# EAGLE design timer (EAGLE 6.2)
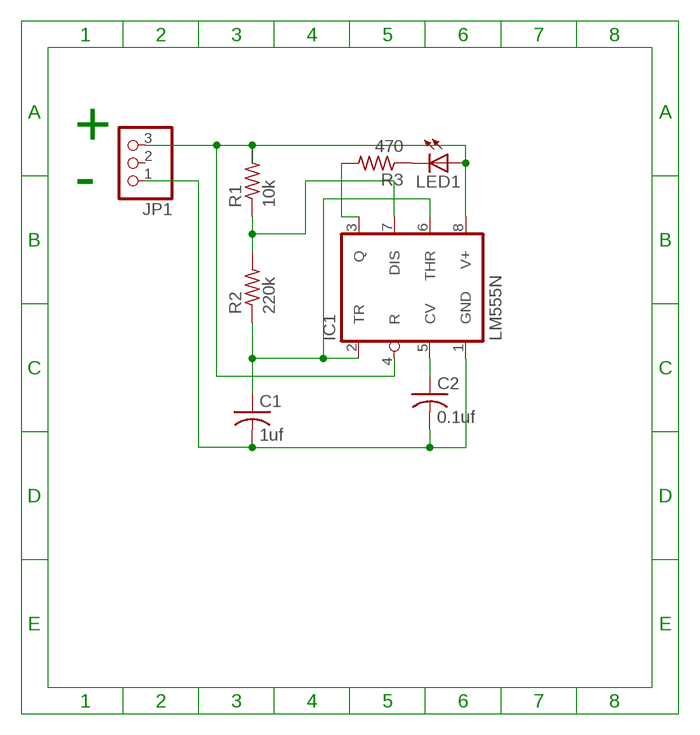
[diagram p0: schematic, sheet 1]

## Parts
C1  1uf  C-US050-025X075  [C050-025X075]
C2  0.1uf  C-US050-025X075  [C050-025X075]
IC1  LM555N  [DIL08-ROUND]
JP1  PINHD-1X3  [1X03]
LED1  LED5MM  [LED5MM]
R1  10k  R-US_0309/10  [0309/10]
R2  220k  R-US_0309/10  [0309/10]
R3  470  R-US_0309/10  [0309/10]

## Nets
N$1: C2.1 IC1.5(CV)
N$2: LED1.K(C) R3.1
N$3: IC1.7(DIS) R1.1 R2.2
N$4: IC1.3(Q) R3.2
N$5: C1.2 C2.2 IC1.1(GND) JP1.1
N$7: IC1.4(R) IC1.8(V+) JP1.3 LED1.A R1.2
N$9: C1.1 IC1.2(TR) IC1.6(THR) R2.1
Unconnected: JP1.2

## Notes on the sheet
- +
- -

## Library data of the parts
C1 C2 = adafruit:C-US: CAPACITOR, American symbol
IC1 = adafruit:*555: TIMER Changed DIP package to have round (not oval) pin pads http://www.ladyada.net/library/pcb/eaglelibrary.html
JP1 = adafruit:PINHD-1X3: PIN HEADER
LED1 = adafruit:LED: LED OSRAM: - CHIPLED LG R971, LG N971, LY N971, LG Q971, LY Q971, LO R971, LY R971 LH N974, LH R974 LS Q976, LO Q976, LY Q976 LO Q996 - Hyper CHIPLED LW Q18S LB Q993, LB Q99A, LB R99A - SideLED LS A670, LO A670, LY A670, LG A670, LP A670 LB A673, LV A673, LT A673, LW A673 LH A674 LY A675 LS A676, LA A676, LO A676, LY A676, LW A676 LS A679, LY A679, LG A679 - Hyper Micro SIDELED® LS Y876, LA Y876, LO Y876, LY Y876 LT Y87S - SmartLED LW L88C, LW L88S LB L89C, LB L89S, LG L890 LS L89K, LO L89K, LY L89K LS L896, LA L896, LO L896, LY L896 - TOPLED LS T670, LO T670, LY T670, LG T670, LP T670 LSG T670, LSP T670, LSY T670, LOP T670, LYG T670 LG T671, LOG T671, LSG T671 LB T673, LV T673, LT T673, LW T673 LH T674 LS T676, LA T676, LO T676, LY T676, LB T676, LH T676, LSB T676, LW T676 LB T67C, LV T67C, LT T67C, LS T67K, LO T67K, LY T67K, LW E67C LS E67B, LA E67B, LO E67B, LY E67B, LB E67C, LV E67C, LT E67C LW T67C LS T679, LY T679, LG T679 LS T770, LO T770, LY T770, LG T770, LP T770 LB T773, LV T773, LT T773, LW T773 LH T774 LS E675, LA E675, LY E675, LS T675 LS T776, LA T776, LO T776, LY T776, LB T776 LHGB T686 LT T68C, LB T68C - Hyper Mini TOPLED® LB M676 - Mini TOPLED Santana® LG M470 LS M47K, LO M47K, LY M47K Source: http://www.osram.convergy.de/
R1-R3 = adafruit:R-US_: RESISTOR, American symbol

## Board
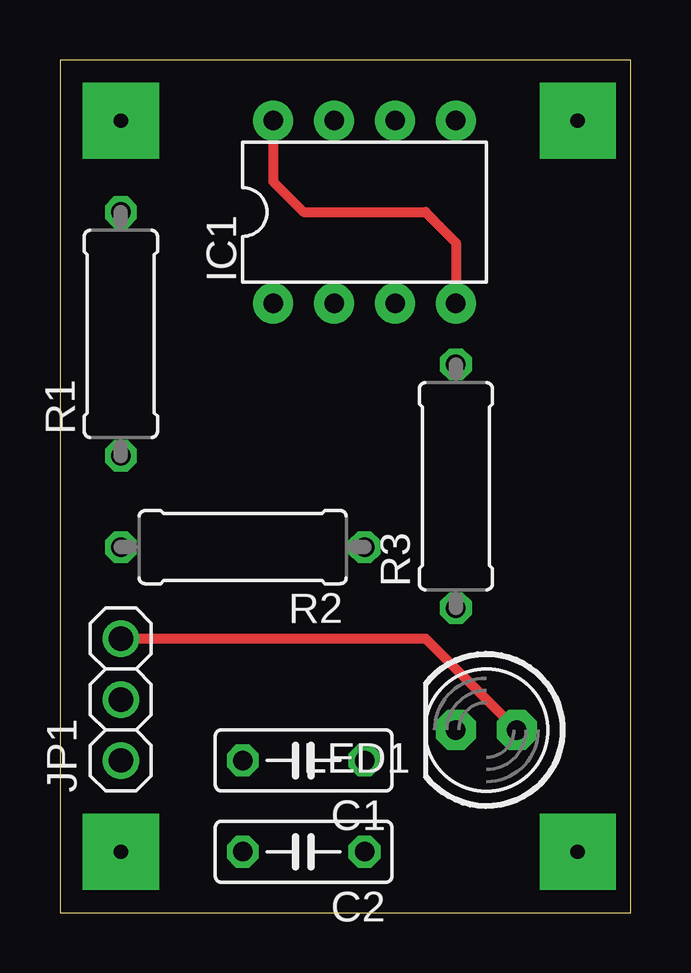
[diagram p1: board, top side]
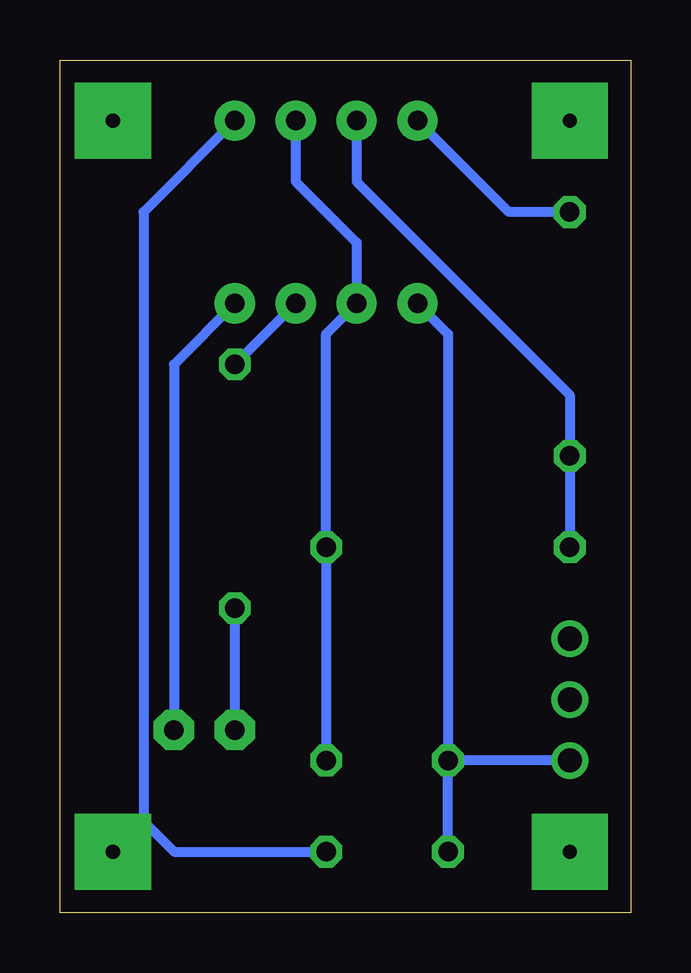
[diagram p2: board, bottom side, seen from below]

Size 23.8 x 35.55 mm. Coordinates in mm from the lower left corner, seen from the top.
Outline: 0,0 23.8,0 23.8,35.55 0,35.55 0,0
Copper layers (1*16): Top 0.035mm / dielectric 1.5mm / Bottom 0.035mm
Design rules "default": minimum track width 10mil, minimum drill 24mil, track to track 8mil, track to pad 8mil, pad to pad 8mil, via to via 8mil, smd to smd 8mil, copper to edge 40mil, drill to drill 8mil, minimum pad ring 10mil, minimum via ring 8mil, stop-mask expansion 4mil, vias tented up to drill 0mil, thermal gap 10mil

### Footprints (pad centres in the part's own frame; a part is rotated, then mirrored left to right if it is on the bottom)
C050-025X075 = drill 0.813 octagon: 1 -2.54,0; 2 2.54,0
DIL08-ROUND = drill 0.813 pad 1.676: 1 -3.81,-3.81; 2 -1.27,-3.81; 3 1.27,-3.81; 4 3.81,-3.81; 5 3.81,3.81; 6 1.27,3.81; 7 -1.27,3.81; 8 -3.81,3.81
1X03 = drill 1.016: 1 -2.54,0; 2 0,0; 3 2.54,0
LED5MM = drill 0.813 pad 1.676 octagon: A -1.27,0; K 1.27,0
0309/10 = drill 0.813 octagon: 1 -5.08,0; 2 5.08,0

### Placement (x,y rotation side)
C1  10.16,6.35 180 top
C2  10.16,2.54 180 top
IC1  12.7,29.21 0 top
JP1  2.54,8.89 90 top
LED1  17.78,7.62 180 top
R1  2.54,24.13 90 top
R2  7.62,15.24 180 top
R3  16.51,17.78 90 top

### Tracks (layer width: path | path; a pad name or v marks a point on that pad's centre or on a via)
N$1
  Bottom 0.406: IC1.5 20.32,29.21 20.32,3.81 19.05,2.54 C2.1
N$2
  Bottom 0.406: R3.1 LED1.K
N$3
  Bottom 0.406: R2.2 R1.1 2.54,21.59 11.43,30.48 IC1.7
N$4
  Bottom 0.406: IC1.3 R3.2
N$5
  Bottom 0.406: C2.2 C1.2 | JP1.1 C1.2 | IC1.1 7.62,24.13 C1.2
N$6  (via drill 0.6 pad 3.17)
  other vias: 2.54,2.54
N$7
  Top 0.406: IC1.8 8.89,30.48 10.16,29.21 15.24,29.21 16.51,27.94 IC1.4 | JP1.3 15.24,11.43 LED1.A
  Bottom 0.406: IC1.4 19.05,22.86 LED1.A | R1.2 5.08,29.21 IC1.8
N$8  (via drill 0.6 pad 3.17)
  other vias: 2.54,33.02
N$9
  Bottom 0.406: C1.1 R2.1 12.7,24.13 IC1.2 11.43,27.94 13.97,30.48 IC1.6
N$10  (via drill 0.6 pad 3.17)
  other vias: 21.59,33.02
N$11  (via drill 0.6 pad 3.17)
  other vias: 21.59,2.54